# EAGLE design phase 1 (EAGLE 6.4)
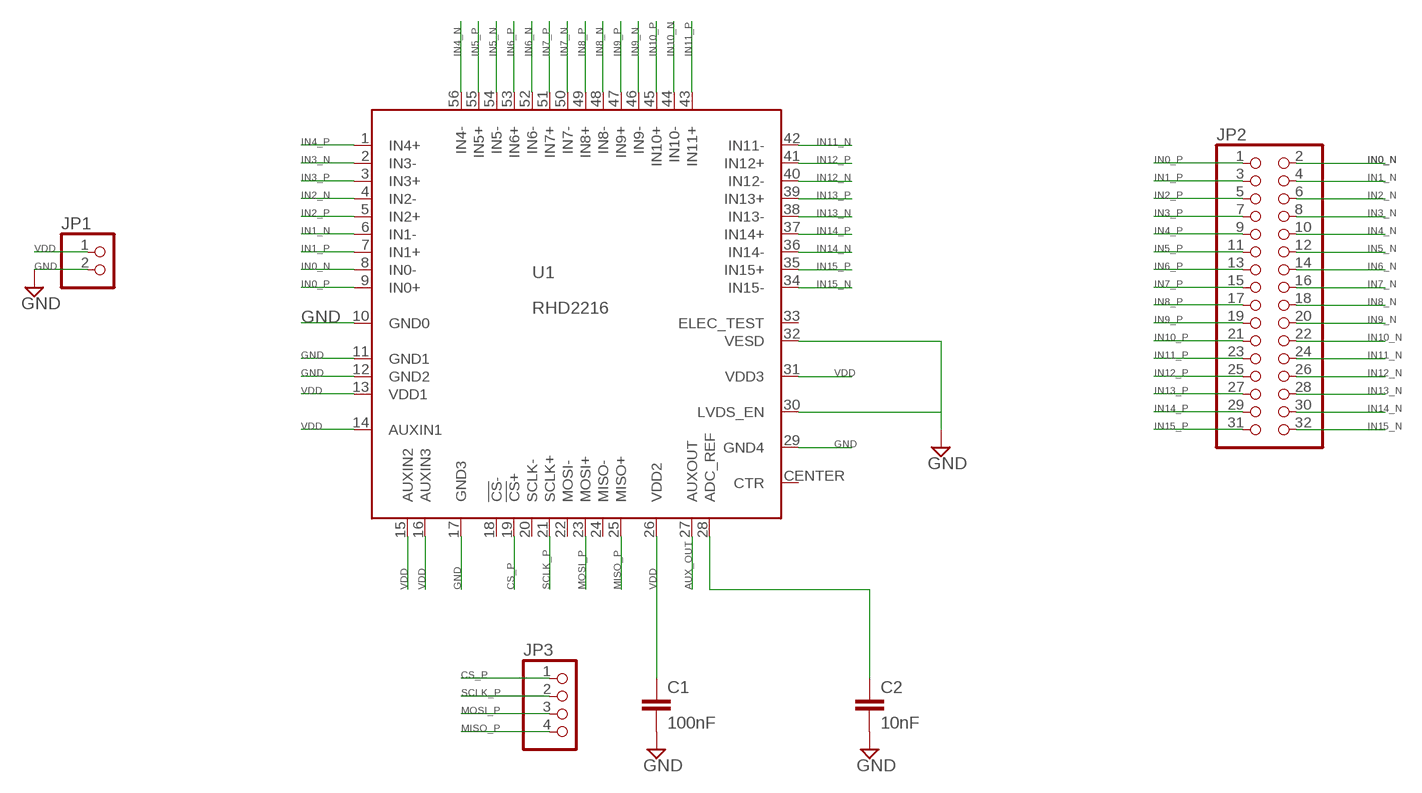
[diagram p0: schematic, sheet 1]

## Parts
C1  100nF  C2.5/2  [C2.5-2]
C2  10nF  C2.5/2  [C2.5-2]
JP1  PINHD-1X2  [1X02]
JP2  PINHD-2X16  [2X16]
JP3  PINHD-1X4  [1X04]
U1  RHD2216  [ZIF_QFN56_8_X_8_MLF00056A1]

## Nets
AUX_OUT: U1.27(AUXOUT)
CS_P: JP3.1 U1.19(!CS!+)
GND: C1.2 C2.2 JP1.2 U1.10(GND0) U1.11(GND1) U1.12(GND2) U1.17(GND3) U1.29(GND4) U1.30(LVDS_EN) U1.32(VESD)
IN0_N: JP2.2 U1.8(IN0-)
IN0_P: JP2.1 U1.9(IN0+)
IN1_N: JP2.4 U1.6(IN1-)
IN1_P: JP2.3 U1.7(IN1+)
IN2_N: JP2.6 U1.4(IN2-)
IN2_P: JP2.5 U1.5(IN2+)
IN3_N: JP2.8 U1.2(IN3-)
IN3_P: JP2.7 U1.3(IN3+)
IN4_N: JP2.10 U1.56(IN4-)
IN4_P: JP2.9 U1.1(IN4+)
IN5_N: JP2.12 U1.54(IN5-)
IN5_P: JP2.11 U1.55(IN5+)
IN6_N: JP2.14 U1.52(IN6-)
IN6_P: JP2.13 U1.53(IN6+)
IN7_N: JP2.16 U1.50(IN7-)
IN7_P: JP2.15 U1.51(IN7+)
IN8_N: JP2.18 U1.48(IN8-)
IN8_P: JP2.17 U1.49(IN8+)
IN9_N: JP2.20 U1.46(IN9-)
IN9_P: JP2.19 U1.47(IN9+)
IN10_N: JP2.22 U1.44(IN10-)
IN10_P: JP2.21 U1.45(IN10+)
IN11_N: JP2.24 U1.42(IN11-)
IN11_P: JP2.23 U1.43(IN11+)
IN12_N: JP2.26 U1.40(IN12-)
IN12_P: JP2.25 U1.41(IN12+)
IN13_N: JP2.28 U1.38(IN13-)
IN13_P: JP2.27 U1.39(IN13+)
IN14_N: JP2.30 U1.36(IN14-)
IN14_P: JP2.29 U1.37(IN14+)
IN15_N: JP2.32 U1.34(IN15-)
IN15_P: JP2.31 U1.35(IN15+)
MISO_P: JP3.4 U1.25(MISO+)
MOSI_P: JP3.3 U1.23(MOSI+)
N$1: C2.1 U1.28(ADC_REF)
SCLK_P: JP3.2 U1.21(SCLK+)
VDD: C1.1 JP1.1 U1.13(VDD1) U1.14(AUXIN1) U1.15(AUXIN2) U1.16(AUXIN3) U1.26(VDD2) U1.31(VDD3)
Unconnected: U1.18(!CS!-) U1.20(SCLK-) U1.22(MOSI-) U1.24(MISO-) U1.33(ELEC_TEST)

## Power pins joined to a net without a drawn wire
CTR: U1.CENTER(CTR)

## Library data of the parts
C1 C2 = capacitor-wima:C: CAPACITOR naming: grid - package width
JP1 = pinhead:PINHD-1X2: PIN HEADER
JP2 = pinhead:PINHD-2X16: PIN HEADER
JP3 = pinhead:PINHD-1X4: PIN HEADER
U1 = RHD2000:RHD2216

## Board
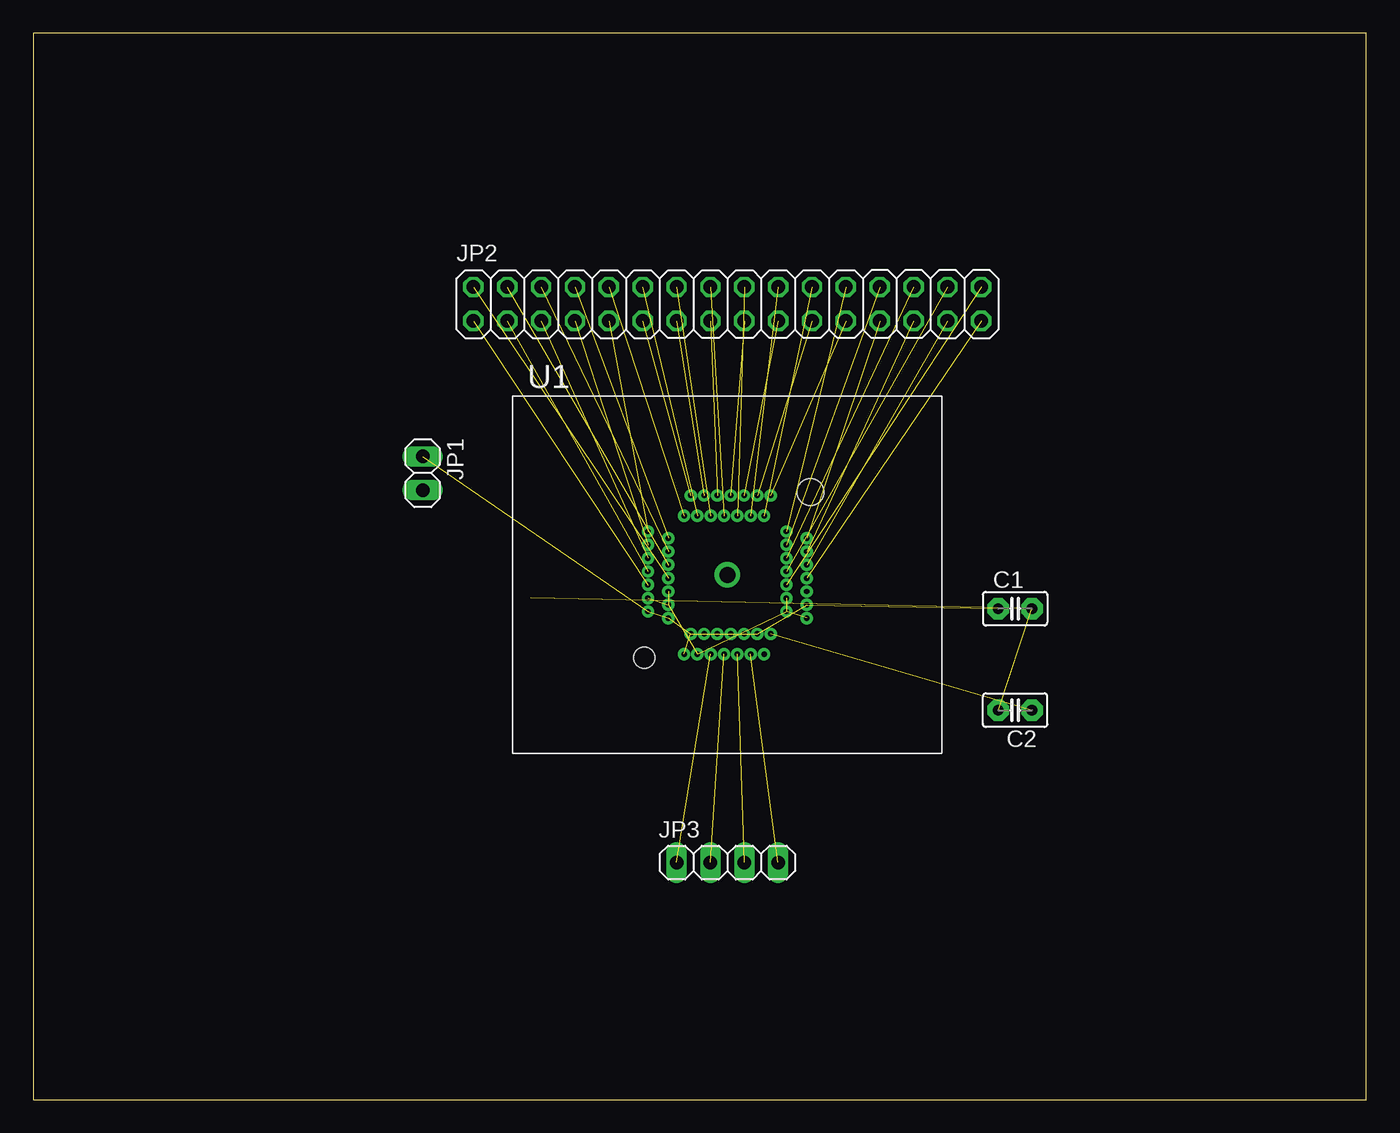
[diagram p1: board, top side]
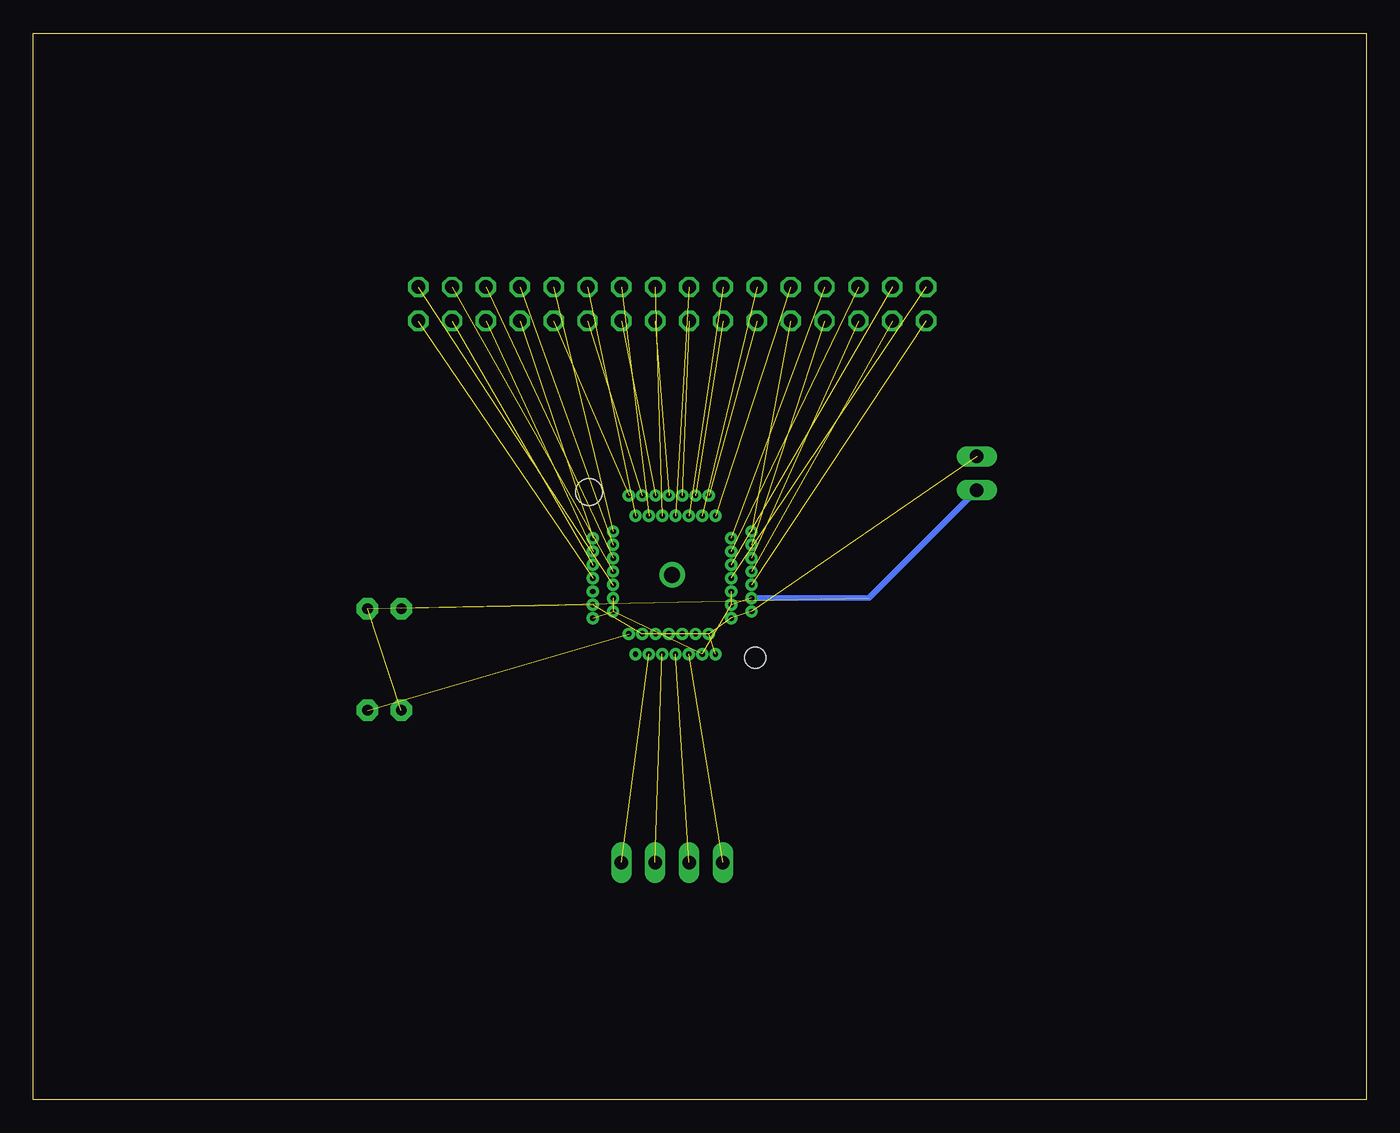
[diagram p2: board, bottom side, seen from below]

Size 100 x 80 mm. Coordinates in mm from the lower left corner, seen from the top.
Outline: 0,0 100,0 100,80 0,80 0,0
Copper layers (1*16): Top 0.035mm / dielectric 1.5mm / Bottom 0.035mm
Design rules "default": minimum track width 10mil, minimum drill 24mil, track to track 8mil, track to pad 8mil, pad to pad 8mil, via to via 8mil, smd to smd 8mil, copper to edge 40mil, drill to drill 8mil, minimum pad ring 10mil, minimum via ring 8mil, stop-mask expansion 4mil, vias tented up to drill 0mil, thermal gap 10mil

### Footprints (pad centres in the part's own frame; a part is rotated, then mirrored left to right if it is on the bottom)
C2.5-2 = drill 0.813 pad 1.6 octagon: 1 -1.27,0; 2 1.27,0
1X02 = drill 1.016 long: 1 -1.27,0; 2 1.27,0
2X16 = drill 1.016 octagon: 1 -19.05,-1.27; 2 -19.05,1.27; 3 -16.51,-1.27; 4 -16.51,1.27; 5 -13.97,-1.27; 6 -13.97,1.27; 7 -11.43,-1.27; 8 -11.43,1.27; 9 -8.89,-1.27; 10 -8.89,1.27; 11 -6.35,-1.27; 12 -6.35,1.27; 13 -3.81,-1.27; 14 -3.81,1.27; 15 -1.27,-1.27; 16 -1.27,1.27; 17 1.27,-1.27; 18 1.27,1.27; 19 3.81,-1.27; 20 3.81,1.27; 21 6.35,-1.27; 22 6.35,1.27; 23 8.89,-1.27; 24 8.89,1.27; 25 11.43,-1.27; 26 11.43,1.27; 27 13.97,-1.27; 28 13.97,1.27; 29 16.51,-1.27; 30 16.51,1.27; 31 19.05,-1.27; 32 19.05,1.27
1X04 = drill 1.016 long: 1 -3.81,0; 2 -1.27,0; 3 1.27,0; 4 3.81,0
ZIF_QFN56_8_X_8_MLF00056A1 = drill 0.41 pad 0.813: 1 -5.955,3.25; 2 -4.43,2.75; 3 -5.955,2.25; 4 -4.43,1.75; 5 -5.955,1.25; 6 -4.43,0.75; 7 -5.955,0.25; 8 -4.43,-0.25; 9 -5.955,-0.75; 10 -4.43,-1.25; 11 -5.955,-1.75; 12 -4.43,-2.25; 13 -5.955,-2.75; 14 -4.43,-3.25; 15 -3.25,-5.955; 16 -2.75,-4.43; 17 -2.25,-5.955; 18 -1.75,-4.43; 19 -1.25,-5.955; 20 -0.75,-4.43; 21 -0.25,-5.955; 22 0.25,-4.43; 23 0.75,-5.955; 24 1.25,-4.43; 25 1.75,-5.955; 26 2.25,-4.43; 27 2.75,-5.955; 28 3.25,-4.43; 29 5.955,-3.25; 30 4.43,-2.75; 31 5.955,-2.25; 32 4.43,-1.75; 33 5.955,-1.25; 34 4.43,-0.75; 35 5.955,-0.25; 36 4.43,0.25; 37 5.955,0.75; 38 4.43,1.25; 39 5.955,1.75; 40 4.43,2.25; 41 5.955,2.75; 42 4.43,3.25; 43 3.25,5.955; 44 2.75,4.43; 45 2.25,5.955; 46 1.75,4.43; 47 1.25,5.955; 48 0.75,4.43; 49 0.25,5.955; 50 -0.25,4.43; 51 -0.75,5.955; 52 -1.25,4.43; 53 -1.75,5.955; 54 -2.25,4.43; 55 -2.75,5.955; 56 -3.25,4.43 | drill 1.2 pad 1.93: CENTER 0,0 | hole 2: 6.225,6.225 | hole 1.6: -6.225,-6.225

### Placement (x,y rotation side)
C1  73.66,36.83 0 top
C2  73.66,29.21 180 top
JP1  29.21,46.99 270 top
JP2  52.07,59.69 0 top
JP3  52.07,17.78 0 top
U1  52.07,39.37 0 top

### Tracks (layer width: path | path; a pad name or v marks a point on that pad's centre or on a via)
CS_P  (1 unrouted)
GND  (8 unrouted)
  Bottom 0.406: U1.11 37.31,37.62 JP1.2
IN0_N  (1 unrouted)
IN0_P  (1 unrouted)
IN1_N  (1 unrouted)
IN1_P  (1 unrouted)
IN2_N  (1 unrouted)
IN2_P  (1 unrouted)
IN3_N  (1 unrouted)
IN3_P  (1 unrouted)
IN4_N  (1 unrouted)
IN4_P  (1 unrouted)
IN5_N  (1 unrouted)
IN5_P  (1 unrouted)
IN6_N  (1 unrouted)
IN6_P  (1 unrouted)
IN7_N  (1 unrouted)
IN7_P  (1 unrouted)
IN8_N  (1 unrouted)
IN8_P  (1 unrouted)
IN9_N  (1 unrouted)
IN9_P  (1 unrouted)
IN10_N  (1 unrouted)
IN10_P  (1 unrouted)
IN11_N  (1 unrouted)
IN11_P  (1 unrouted)
IN12_N  (1 unrouted)
IN12_P  (1 unrouted)
IN13_N  (1 unrouted)
IN13_P  (1 unrouted)
IN14_N  (1 unrouted)
IN14_P  (1 unrouted)
IN15_N  (1 unrouted)
IN15_P  (1 unrouted)
MISO_P  (1 unrouted)
MOSI_P  (1 unrouted)
N$1  (1 unrouted)
SCLK_P  (1 unrouted)
VDD  (7 unrouted)